# Altium schematic sheet CPU.SchDoc
size A4
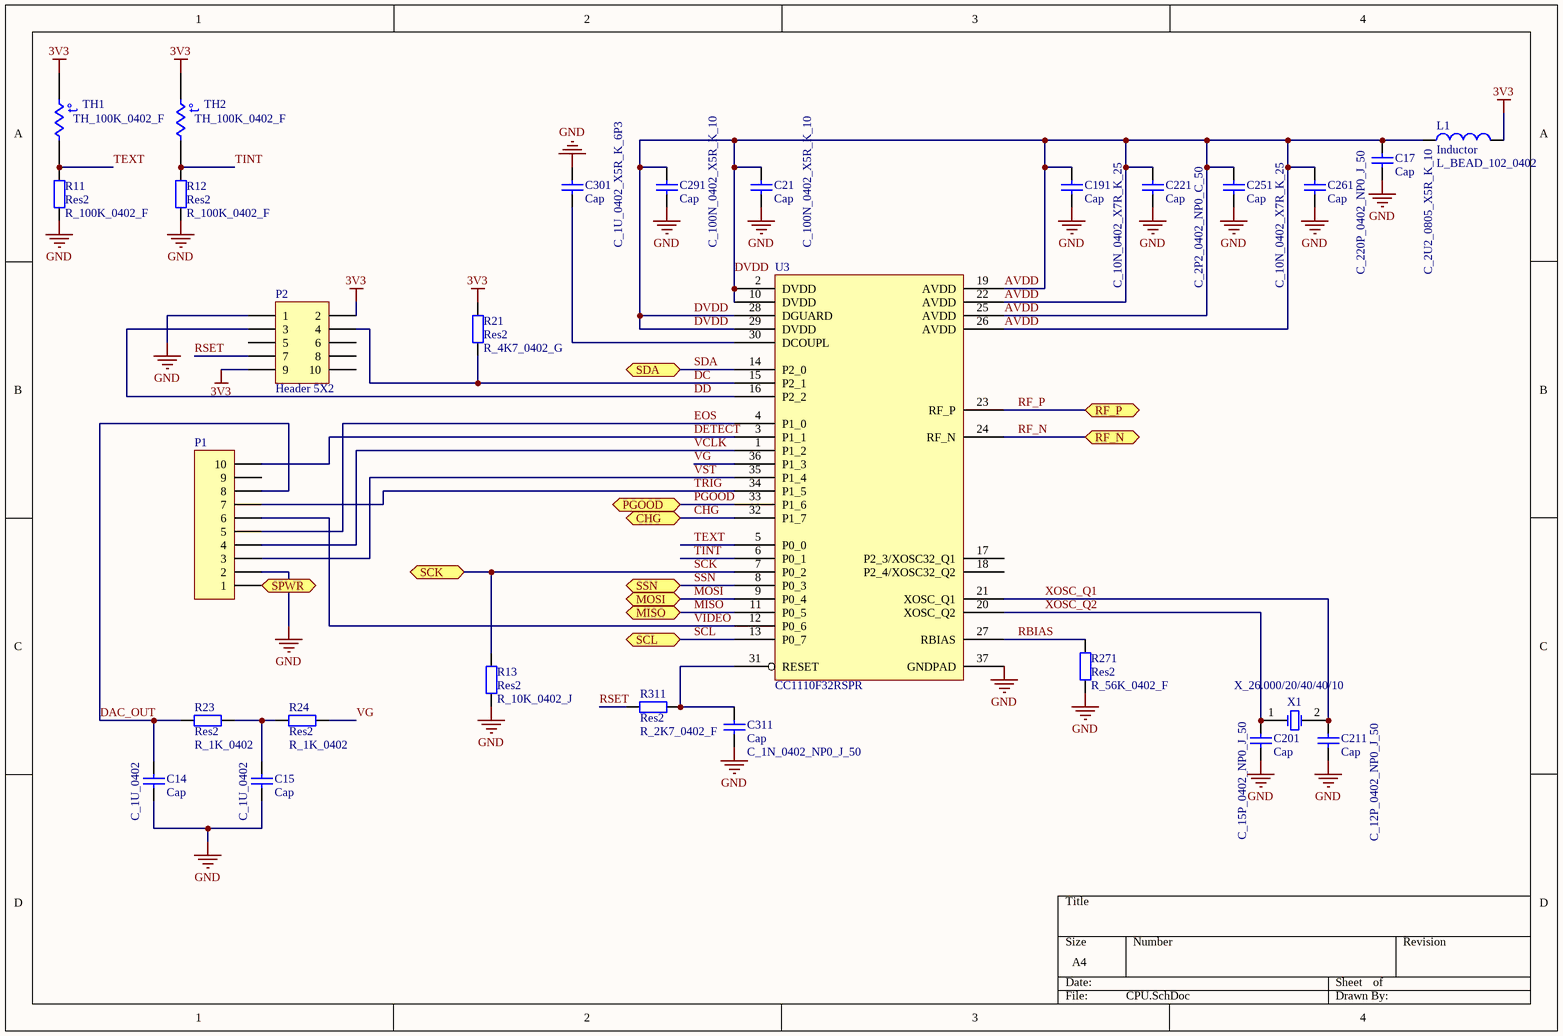
[diagram p0: CPU.SchDoc]

## Parts
C14  Cap  value C_1U_0402  [C_0402]
C15  Cap  value C_1U_0402  [C_0402]
C17  Cap  value C_2U2_0805_X5R_K_10  [C_0805]
C21  Cap  value C_100N_0402_X5R_K_10  [C_0402]
C191  Cap  value C_10N_0402_X7R_K_25  [C_0402]
C201  Cap  value C_15P_0402_NP0_J_50  [C_0402]
C211  Cap  value C_12P_0402_NP0_J_50  [C_0402]
C221  Cap  value C_2P2_0402_NP0_C_50  [C_0402]
C251  Cap  value C_10N_0402_X7R_K_25  [C_0402]
C261  Cap  value C_220P_0402_NP0_J_50  [C_0402]
C291  Cap  value C_100N_0402_X5R_K_10  [C_0402]
C301  Cap  value C_1U_0402_X5R_K_6P3  [C_0402]
C311  Cap  value C_1N_0402_NP0_J_50  [C_0402]
L1  Inductor  value L_BEAD_102_0402  [R_0402]
P1  Header 10  [609-4377-ND Female]  (value not drawn)
P2  Header 5X2  [SMD HEADER]
R11  Res2  value R_100K_0402_F  [R_0402]
R12  Res2  value R_100K_0402_F  [R_0402]
R13  Res2  value R_10K_0402_J  [R_0402]
R21  Res2  value R_4K7_0402_G  [R_0402]
R23  Res2  value R_1K_0402  [R_0402]
R24  Res2  value R_1K_0402  [R_0402]
R271  Res2  value R_56K_0402_F  [R_0402]
R311  Res2  value R_2K7_0402_F  [R_0402]
TH1  value TH_100K_0402_F  [R_0402]  (hidden comment: Res Thermal)
TH2  value TH_100K_0402_F  [R_0402]  (hidden comment: Res Thermal)
U3  CC1110F32RSPR  [TI_QFP36]
X1  X_26.000/20/40/40/10  [NX3225GA]

## Ports
CHG, MISO, MOSI, PGOOD, RF_N, RF_P, SCK, SCL, SDA, SPWR, SSN

## Nets
3V3: L1.2 P2.2 P2.9 R21.2 TH1.1 TH2.1
GND: C14.1 C15.1 C17.1 C21.1 C191.1 C201.1 C211.1 C221.1 C251.1 C261.1 C291.1 C301.2 C311.1 P1.2 P2.1 R11.1 R12.1 R13.1 R271.1 U3.37(GNDPAD)
AVDD: C17.2 C21.2 C191.2 C221.2 C251.2 C261.2 C291.2 L1.1 U3.2(DVDD) U3.10(DVDD) U3.19(AVDD) U3.22(AVDD) U3.25(AVDD) U3.26(AVDD) U3.28(DGUARD) U3.29(DVDD)  [also labelled DVDD]
CHG: U3.32(P1_7) ; port CHG
DAC_OUT: C14.2 P1.8 R23.2
DC: P2.4 R21.1 U3.15(P2_1)
DD: P2.3 U3.16(P2_2)
DETECT: P1.10 U3.3(P1_1)
EOS: P1.5 U3.4(P1_0)
MISO: U3.11(P0_5) ; port MISO
MOSI: U3.9(P0_4) ; port MOSI
PGOOD: U3.33(P1_6) ; port PGOOD
RBIAS: R271.2 U3.27(RBIAS)
RF_N: U3.24(RF_N) ; port RF_N
RF_P: U3.23(RF_P) ; port RF_P
RSET: P2.7 R311.1
SCK: R13.2 U3.7(P0_2) ; port SCK
SCL: U3.13(P0_7) ; port SCL
SDA: U3.14(P2_0) ; port SDA
SPWR: P1.1 ; port SPWR
SSN: U3.8(P0_3) ; port SSN
TEXT: R11.2 TH1.2 U3.5(P0_0)
TINT: R12.2 TH2.2 U3.6(P0_1)
TRIG: P1.7 U3.34(P1_5)
VCLK: P1.4 U3.1(P1_2)
VG: R24.1 U3.36(P1_3)
VIDEO: P1.6 U3.12(P0_6)
VST: P1.3 U3.35(P1_4)
XOSC_Q1: C211.2 U3.21(XOSC_Q1) X1.2(OSC2)
XOSC_Q2: C201.2 U3.20(XOSC_Q2) X1.1(OSC1)
NetC15_2: C15.2 R23.1 R24.2
NetC301_1: C301.1 U3.30(DCOUPL)
NetC311_2: C311.2 R311.2 U3.31(RESET)

Not connected (* = marked no-connect by the designer): P1 9; P2 5 6 8 10; U3 17(P2_3/XOSC32_Q1) 18(P2_4/XOSC32_Q2)

## Notes on the sheet
- (in symbol Res Thermal) t°

## Library data of the parts
C14 C15 C17 C21 C191 C201 C211 C221 C251 C261 C291 C301 C311 = Cap: Capacitor; Published: 8-Jun-2000; LatestRevisionDate: 17-Jul-2002; LatestRevisionNote: Re-released for DXP Platform.; Publisher: Altium Limited; Supplier 1: Digi-Key
  C14 C15: Supplier Part Number 1: 587-1231-1-ND
  C17: Supplier Part Number 1: 445-3459-1-ND; Supplier 2: Mouser; Supplier Part Number 2: 81-GRM219R61A225KA1D
  C21 C291: Supplier Part Number 1: 490-1318-6-ND; Supplier 2: Mouser; Supplier Part Number 2: 81-GRM155R61A104KA01
  C191 C251: Supplier Part Number 1: 490-1312-1-ND
  C201: Supplier Part Number 1: 490-1280-1-ND; Supplier 2: Mouser; Supplier Part Number 2: 81-GRM36C150J50
  C211: Supplier Part Number 1: 490-1279-1-ND; Supplier 2: Mouser; Supplier Part Number 2: 81-GRM36C120J50
  C221: Supplier Part Number 1: 490-1267-1-ND; Supplier 2: Mouser; Supplier Part Number 2: 81-GRM36C2R2C50
  C261: Supplier Part Number 1: 490-1293-1-ND; Supplier 2: Mouser; Supplier Part Number 2: 81-GRM1555C1H221JA01
  C301: Supplier Part Number 1: 490-1320-1-ND; Supplier 2: Mouser; Supplier Part Number 2: 81-GRM155R60J105KE19
  C311: Supplier Part Number 1: 490-3244-1-ND; Supplier 2: Mouser; Supplier Part Number 2: 81-GRM1555C1H102JA1D
L1 = Inductor: Code_IEC: 1005; Published: 8-Jun-2000; LatestRevisionDate: 29-May-2009; LatestRevisionNote: IPC-7351 Footprint Added.; PackageReference: 0402-A; Publisher: Altium Limited; PackageDescription: Chip Inductor; Code_JEITA: 0402; Supplier 1: Digi-Key; Supplier Part Number 1: 490-3999-1-ND; Supplier 2: Mouser; Supplier Part Number 2: 81-BLM15HG102SN1D
P1 = Header 10: Header, 10-Pin; LatestRevisionDate: 17-Jul-2002; LatestRevisionNote: Re-released for DXP Platform.; Publisher: Altium Limited
P2 = Header 5X2: Header, 5-Pin, Dual row; LatestRevisionDate: 17-Jul-2002; LatestRevisionNote: Re-released for DXP Platform.; Publisher: Altium Limited; Supplier 1: Digi-Key; Supplier Part Number 1: FTSH-105-01-L-DV-TR-ND
R11-R13 R21 R23 R24 R271 R311 = Res2: Resistor; Published: 8-Jun-2000; LatestRevisionDate: 17-Jul-2002; LatestRevisionNote: Re-released for DXP Platform.; Publisher: Altium Limited; Supplier 1: Digi-Key
  R11 R12: Supplier Part Number 1: 541-100KLCT-ND; Supplier 2: Mouser; Supplier Part Number 2: 71-CRCW0402-100K-E3
  R13: Supplier Part Number 1: P10KJCT-ND; Supplier 2: Mouser; Supplier Part Number 2: 667-ERJ-2GEJ103X
  R21: PackageReference: AXIAL-0.4; PackageDescription: Axial Device, Thru-Hole; 2 Leads; 0.4 in Pin Spacing; Supplier Part Number 1: 311-4.7KJRCT-ND
  R23 R24: Supplier Part Number 1: RMCF0402JT1K00CT-ND
  R271: Supplier Part Number 1: 541-56.0KLCT-ND; Supplier 2: Mouser; Supplier Part Number 2: 71-CRCW040256K0FKED
  R311: Supplier Part Number 1: 541-2.70KLCT-ND; Supplier 2: Mouser; Supplier Part Number 2: 71-CRCW0402-2.7K-E3
TH1 TH2 = Res Thermal: Thermistor; Published: 24-Mar-1999; LatestRevisionDate: 29-May-2009; LatestRevisionNote: IPC-7351 Footprint Added.; PackageVersion: Mar-2003; PackageReference: 6-0805; Publisher: Altium Limited; PackageDescription: Chip Resistor 0805 Case Size; Code_IPC: RESC2012; Supplier 1: Digi-Key; Supplier Part Number 1: 490-4803-1-ND; Supplier 2: Mouser; Supplier Part Number 2: 81-NCP15WF104F03RC
U3 = CC1110F32RSPR: RF Microcontrollers (MCU) True System-on-Chip; Manufacturer: Texas Instruments; Interface Type: 3-Wire SPI; Supply Voltage (Max): 3.6 V; Supply Voltage (Min): 2 V; Operating Supply Voltage: 2 V to 3.6 V; Manufacturer Part Number: CC1110F32RSPR; RoHS: RoHS Compliant; Category: RF Microcontrollers (MCU); Stock 1: 10995; Pricing 1: 1=5.75, 25=4.60, 100=3.68, 250=3.06, 500=2.99, 1000=2.95, 2000=2.90, 2500=2.90 (USD); Operating Temperature Range: - 40 C to + 85 C; Package / Case: QFN-36; Packaging: Reel; Mounting Style: SMD/SMT; Maximum Operating Temperature: + 85 C; Minimum Operating Temperature: - 40 C; Product Category: RF Integrated Circuits; Standard Pack Qty: 2500; RoHS - Mouser: Y; Minimum Order Quantity: 1; Reeling: True; ComponentLink1URL: http://www.ti.com/lit/ds/symlink/cc1110f32.pdf; ComponentLink1Description: http://www.ti.com/lit/ds/symlink/cc1110f32.pdf; Supplier 1: Digi-Key; Supplier Part Number 1: CC1110F32RSPG3-ND; Supplier 2: Mouser; Supplier Part Number 2: 595-CC1110F32RSPR; Supplier 3: Digi-Key; Supplier Part Number 3: 296-22740-1-ND; Supplier 4: Digi-Key; Supplier Part Number 4: 296-22740-2-ND; Supplier 5: Digi-Key; Supplier Part Number 5: 296-22740-6-ND
X1 = XTAL: Crystal Oscillator; Published: 8-Jun-2000; LatestRevisionDate: 17-Jul-2002; LatestRevisionNote: Re-released for DXP Platform.; PackageReference: R38; Publisher: Altium Limited; PackageDescription: Crystal, Thru-Hole; 2 Leads; Body 3.1 x 8.2 mm (Dia.xH); Supplier 1: Digi-Key; Supplier Part Number 1: 644-1160-2-ND